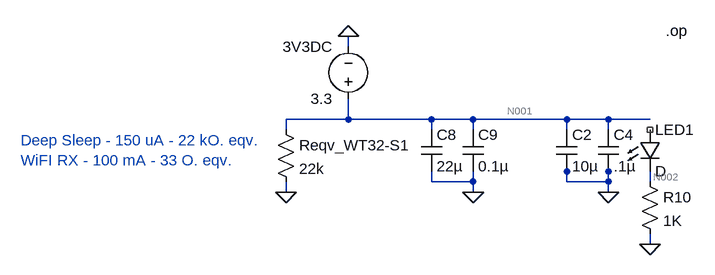
[diagram p0: schematic WT32-ETH01v2_LTSpice.asc]
WT32-ETH01v2_LTSpice.asc, the LTspice schematic file:
Version 4.1
SHEET 1 880 680
WIRE 336 16 336 0
WIRE 336 128 336 96
WIRE 336 128 240 128
WIRE 464 128 336 128
WIRE 528 128 464 128
WIRE 672 128 528 128
WIRE 736 128 672 128
WIRE 800 128 736 128
WIRE 240 144 240 128
WIRE 464 144 464 128
WIRE 528 144 528 128
WIRE 672 144 672 128
WIRE 736 144 736 128
WIRE 672 208 672 192
WIRE 736 208 736 192
WIRE 464 224 464 208
WIRE 528 224 528 208
WIRE 528 224 464 224
WIRE 672 224 672 208
WIRE 736 224 736 208
WIRE 736 224 672 224
WIRE 800 224 800 208
WIRE 240 240 240 224
WIRE 528 240 528 224
WIRE 736 240 736 224
WIRE 800 320 800 304
FLAG 336 0 0
FLAG 240 240 0
FLAG 528 240 0
FLAG 736 240 0
FLAG 800 320 0
SYMBOL voltage 336 112 R180
WINDOW 0 24 96 Left 2
WINDOW 3 24 16 Left 2
SYMATTR InstName 3V3DC
SYMATTR Value 3.3
SYMBOL res 224 128 R0
SYMATTR InstName Reqv_WT32-S1
SYMATTR Value 22k
SYMBOL cap 448 144 R0
SYMATTR InstName C8
SYMATTR Value 22µ
SYMBOL cap 512 144 R0
SYMATTR InstName C9
SYMATTR Value 0.1µ
SYMBOL cap 656 144 R0
SYMATTR InstName C2
SYMATTR Value 10µ
SYMBOL cap 720 144 R0
SYMATTR InstName C4
SYMATTR Value .1µ
SYMBOL LED 784 144 R0
SYMATTR InstName LED1
SYMBOL res 784 208 R0
SYMATTR InstName R10
SYMATTR Value 1K
TEXT -168 160 Left 2 ;Deep Sleep - 150 uA - 22 kO. eqv.\nWiFI RX - 100 mA - 33 O. eqv.
TEXT 824 -8 Left 2 !.op

The netlist it stands for:
* WT32-ETH01v2_LTSpice.asc
V§3V3DC N001 0 3.3
Reqv_WT32-S1 N001 0 22k
C8 N001 0 22µ
C9 N001 0 0.1µ
C2 N001 0 10µ
C4 N001 0 .1µ
D§LED1 NC_01 N002 D
R10 N002 0 1K
.model D D
.lib standard.dio
* Deep Sleep - 150 uA - 22 kO. eqv.
* WiFI RX - 100 mA - 33 O. eqv.
.op
.backanno
.end

* Results of the author's LTspice run, read from the files saved beside the schematic
* Operating Point:
*   V(n001) = 3.3 V
*   V(n002) = 0 V
*   I(3V3DC) = -150 µA
*   I(C2) = 0 A
*   I(C4) = 0 A
*   I(C8) = 0 A
*   I(C9) = 0 A
*   I(LED1) = 0 A
*   I(R10) = 0 A
*   I(Reqv_WT32-S1) = 150 µA